# EasyEDA Pro project Hausdeckenlicht.eprj

# Schematic Deckenlicht
Board Name: Board1; Create Date: 2026-02-10; Page Name: P1; Project Name: Hausdeckenlicht; Schematic Name: Deckenlicht; Update Date: 2026-03-19; Company: EasyEDA.com; Page Size: A4; Version: V1.1
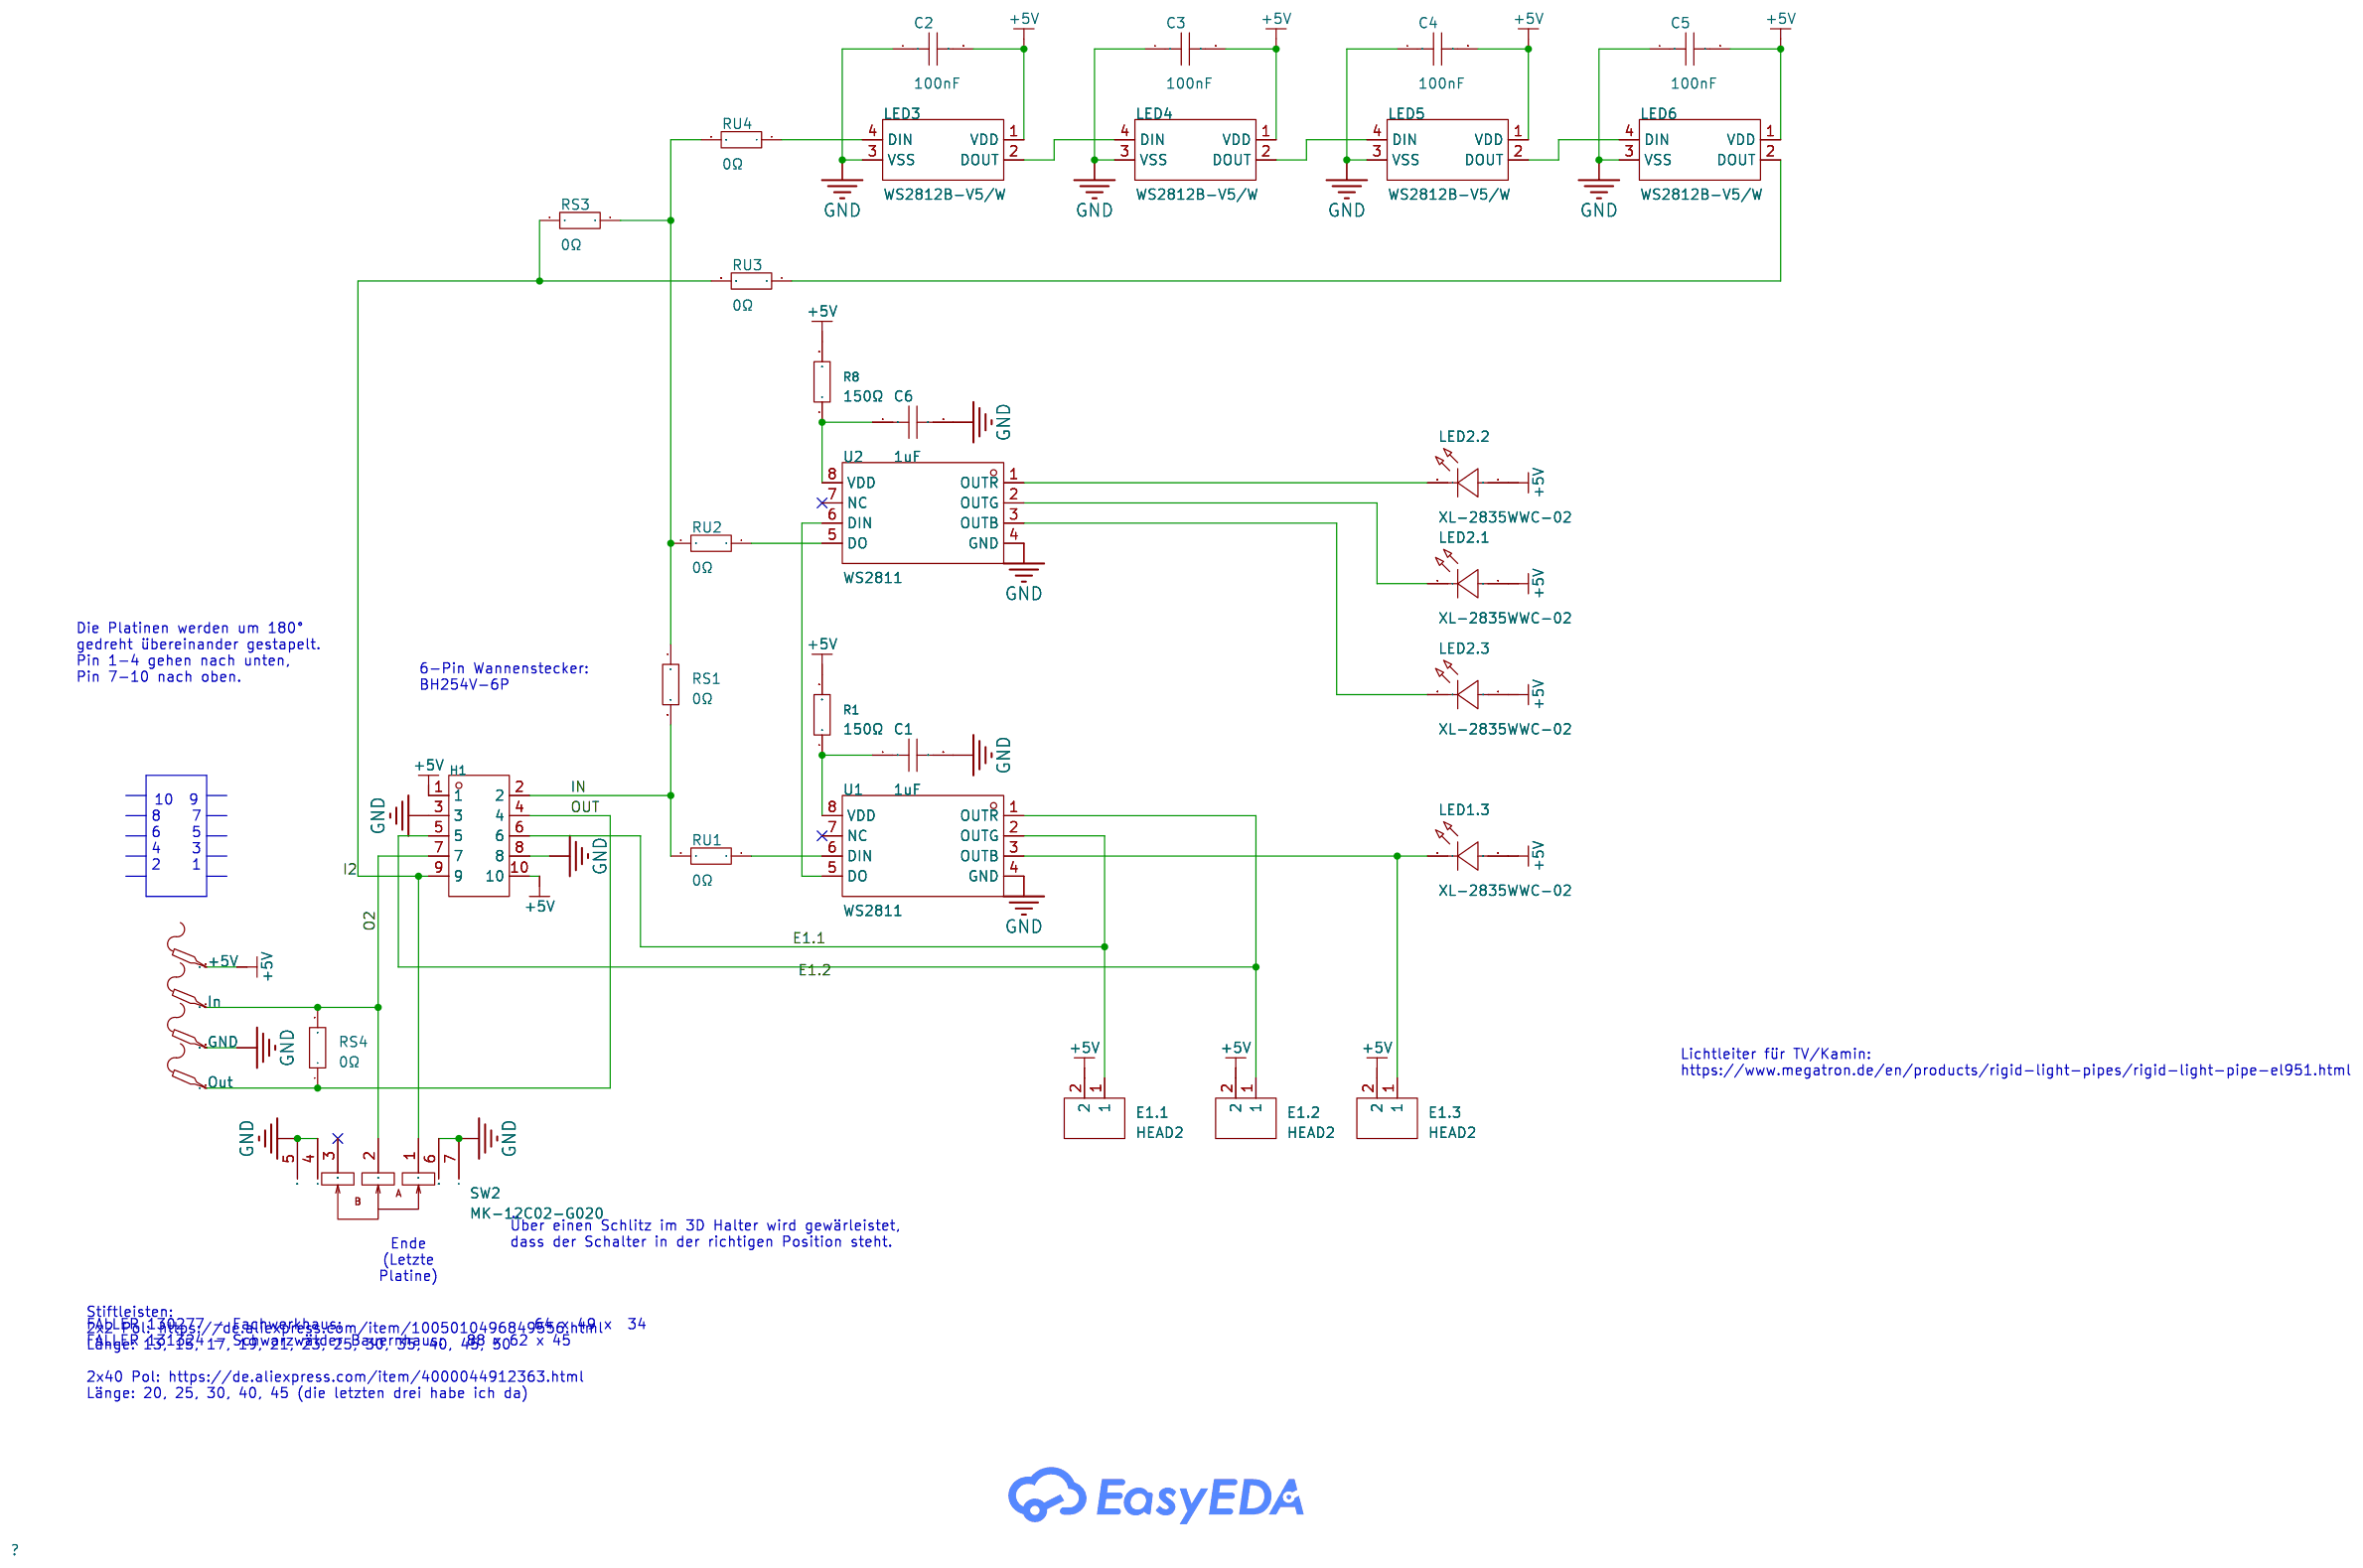
[diagram p0: schematic sheet]

## Parts
+5V  -  [Test-Point-0.5mm]
C1  1uF  [C0603]
C2  100nF  [C0603]
C3  100nF  [C0603]
C4  100nF  [C0603]
C5  100nF  [C0603]
C6  1uF  [C0603]
E1.1  HEAD2  [HDR-TH_2P-P2.54-V-M]  (no BOM)
E1.2  HEAD2  [HDR-TH_2P-P2.54-V-M]  (no BOM)
E1.3  HEAD2  [HDR-TH_2P-P2.54-V-M]  (no BOM)
GND  -  [Test-Point-0.5mm]
H1  2.54-2*5P立贴母  [CONN-SMD_C843271]
In  -  [Test-Point-0.5mm]
LED1.3  XL-2835WWC-02  [LED-SMD_L3.5-W2.8-R-RD]
LED2.1  XL-2835WWC-02  [LED-SMD_L3.5-W2.8-R-RD]
LED2.2  XL-2835WWC-02  [LED-SMD_L3.5-W2.8-R-RD]
LED2.3  XL-2835WWC-02  [LED-SMD_L3.5-W2.8-R-RD]
LED3  WS2812B-V5/W  [LED-SMD_4P-L5.0-W5.0-TL-1]
LED4  WS2812B-V5/W  [LED-SMD_4P-L5.0-W5.0-TL-1]
LED5  WS2812B-V5/W  [LED-SMD_4P-L5.0-W5.0-TL-1]
LED6  WS2812B-V5/W  [LED-SMD_4P-L5.0-W5.0-TL-1]
Out  -  [Test-Point-0.5mm]
R1  150Ω  [R0603]
R8  150Ω  [R0603]
RS1  0Ω  [R0603]  (no BOM)
RS3  0Ω  [R0603]  (no BOM)
RS4  0Ω  [R0603]
RU1  0Ω  [R0603]
RU2  0Ω  [R0603]
RU3  0Ω  [R0603]
RU4  0Ω  [R0603]
SW2  MK-12C02-G020  [SW-SMD_MK-12C02-G020]
U1  WS2811  [SOP-8_L4.9-W3.9-P1.27-LS6.0-BL]
U2  WS2811  [SOP-8_L4.9-W3.9-P1.27-LS6.0-BL]

## Library data of the parts
+5V GND In Out = Test-Point
C1 C6 = CL10A105KB8NNNC: LCSC Part Name: 1uF ±10% 50V; Supplier Part: C15849; Manufacturer: SAMSUNG(三星); Supplier Footprint: 0603; JLCPCB Part Class: Basic Part; Datasheet: https://item.szlcsc.com/datasheet/CL10A105KB8NNNC/16531.html; Supplier: LCSC; Tolerance: ±10%; Voltage Rating: 50V; Temperature Coefficient: X5R
C2-C5 = CC0603KRX7R9BB104: LCSC Part Name: 100nF ±10% 50V; Supplier Part: C14663; Manufacturer: YAGEO(国巨); Supplier Footprint: 0603; JLCPCB Part Class: Basic Part; Datasheet: https://item.szlcsc.com/datasheet/CC0603KRX7R9BB104/15331.html; Supplier: LCSC; Tolerance: ±10%; Voltage Rating: 50V; Temperature Coefficient: X7R
E1.1-E1.3 = HEAD2: Supplier Part: C9900010030; Supplier Footprint: HDR-TH_2P-P2.54; JLCPCB Part Class: Extended Part; Supplier: LCSC
H1 = 2.54-2*5P立贴母: LCSC Part Name: 间距:2.54mm 2x5P 立贴; Supplier Part: C843271; Manufacturer: BOOMELE(博穆精密); Supplier Footprint: SMD,P=2.54mm; JLCPCB Part Class: Extended Part; Datasheet: https://item.szlcsc.com/datasheet/2.54-2*5P%25E7%25AB%258B%25E8%25B4%25B4%25E6%25AF%258D/902207.html; Supplier: LCSC; Holes Structure: 2x5P; Pitch: 2.54mm; Row Spacing: 2.54mm; Circular Hole / Square Hole: Square Hole; Mounting Type: Surface Mount,Vertical; Number of Rows: 2; Number of Positions: 10P; Current Rating: 2.5A; Holes Direction: Top; Insulation Height: 8.5mm; Contact Material: Brass; Contact Plating: Gold; Operating Temperature: -55℃~+105℃
LED1.3 LED2.1-LED2.3 = XL-2835WWC-02: LCSC Part Name: 暖白色 2835暖白0.2W贴片式发光二极管; Supplier Part: C2843875; Manufacturer: XINGLIGHT(成兴光); Supplier Footprint: SMD2835-2P; JLCPCB Part Class: Extended Part; Datasheet: https://item.szlcsc.com/datasheet/XL-2835WWC-02/3033176.html; Supplier: LCSC; Illumination Color: Warm White; Voltage - Forward(Vf): 3.4V; Power(Watts): 200mW; Forward Current: 60mA; Lens Color: Yellow Lens; Color Temperature: 2900K~3100K; Viewing Angle: 120°; Mounting Style: op View Mount; Operating Temperature: -20℃~+85℃
LED3-LED6 = WS2812B-V5/W: LCSC Part Name: RGB三色; Supplier Part: C2874885; Manufacturer: worldsemi; Supplier Footprint: SMD5050; JLCPCB Part Class: Extended Part; Datasheet: https://atta.szlcsc.com/upload/public/pdf/source/20241202/615CE05766148E9C4DD7D8CE8DBC7337.pdf; Supplier: LCSC
R1 R8 = 0603WAF1500T5E: LCSC Part Name: 150Ω ±1% 100mW 厚膜电阻; Supplier Part: C22808; Manufacturer: UNI-ROYAL(厚声); Supplier Footprint: 0603; JLCPCB Part Class: Basic Part; Datasheet: https://atta.szlcsc.com/upload/public/pdf/source/20200306/C422600_1E6D84923E4A46A82E41ADD87F860B5C.pdf; Supplier: LCSC; Type: Thick Film Resistors; Tolerance: ±1%; Temperature Coefficient: ±100ppm/℃; Operating Temperature Range: -55℃~+155℃
RS1 RS3 RS4 RU1-RU4 = 0603WAF0000T5E: LCSC Part Name: 0Ω ±1% 100mW 厚膜电阻; Supplier Part: C21189; Manufacturer: UNI-ROYAL(厚声); Supplier Footprint: 0603; JLCPCB Part Class: Basic Part; Datasheet: https://item.szlcsc.com/datasheet/0603WAF0000T5E/21903.html; Supplier: LCSC; Type: Thick Film Resistor; Tolerance: ±1%; Power(Watts): 100mW; Voltage-Supply(Max): 75V; Operating Temperature: -55℃~+155℃
SW2 = MK-12C02-G020: LCSC Part Name: 微型拨动开关; Supplier Part: C963206; Manufacturer: G-Switch(品赞); Supplier Footprint: SMD,6.6x1.4mm; JLCPCB Part Class: Extended Part; Datasheet: https://item.szlcsc.com/datasheet/MK-12C02-G020/1046841.html; Supplier: LCSC; Circuit: SPDT; Actuator Style: Rectangular Columnar; Length: 6.6mm; Width: 1.4mm; Switch Height: 4.7mm; Mounting Type: Surface Mount, Right Angle; Actuator Color: Black; Current Rating: 1A; Voltage Rating: 6V; Life: 10,000 Cycles; Operating Temperature: -20℃~+70℃
U1 U2 = WS2811: Supplier Part: C114581; Manufacturer: worldsemi; Supplier Footprint: SOP-8; JLCPCB Part Class: Extended Part; Datasheet: https://item.szlcsc.com/datasheet/WS2811/115825.html; Supplier: LCSC; Voltage - Input(DC): 5V~24V; Frequency - Switching: 800kHz; Number of Channels: 3; Output Voltage: 20V; Output Current: 16.5mA; Dimming: PWM; Operating temperature: -25℃~+85℃

## Nets
+5V: +5V.1 C2.2 C3.2 C4.2 C5.2 E1.1.2 E1.2.2 E1.3.2 H1.1 H1.10 LED1.3.1(A) LED2.1.1(A) LED2.2.1(A) LED2.3.1(A) LED3.1(VDD) LED4.1(VDD) LED5.1(VDD) LED6.1(VDD) R1.2 R8.2
GND: C1.2 C2.1 C3.1 C4.1 C5.1 C6.2 GND.1 H1.3 H1.8 LED3.3(VSS) LED4.3(VSS) LED5.3(VSS) LED6.3(VSS) SW2.4 SW2.5 SW2.6 SW2.7 U1.4(GND) U2.4(GND)
E1.1: E1.1.1 H1.6 U1.2(OUTG)
E1.2: E1.2.1 H1.5 U1.1(OUTR)
I2: H1.9 RS3.2 RU3.2 SW2.1
IN: H1.2 RS1.2 RU1.2
O2: H1.7 In.1 RS4.2 SW2.2
OUT: H1.4 Out.1 RS4.1
$1N2323: E1.3.1 LED1.3.2(K) U1.3(OUTB)
$1N2342: C1.1 R1.1 U1.8(VDD)
$1N3914: C6.1 R8.1 U2.8(VDD)
$1N3929: LED2.1.2(K) U2.2(OUTG)
$1N3934: LED2.3.2(K) U2.3(OUTB)
$1N3939: LED2.2.2(K) U2.1(OUTR)
$1N4178: LED3.2(DOUT) LED4.4(DIN)
$1N4186: LED4.2(DOUT) LED5.4(DIN)
$1N4194: LED5.2(DOUT) LED6.4(DIN)
$1N5592: LED3.4(DIN) RU4.1
$1N5642: LED6.2(DOUT) RU3.1
$1N5658: U1.5(DO) U2.6(DIN)
$1N5698: RU1.1 U1.6(DIN)
$1N5721: RU2.1 U2.5(DO)
$1N5728: RS1.1 RS3.1 RU2.2 RU4.2

Not connected (* = marked no-connect by the designer): SW2 3*; U1 7(NC)*; U2 7(NC)*

## Notes on the sheet
- Die Platinen werden um 180°
  gedreht übereinander gestapelt.
  Pin 1-4 gehen nach unten,
  Pin 7-10 nach oben.
- 6-Pin Wannenstecker:
  BH254V-6P
- 10  9
  8    7
  6    5
  4    3
  2    1
- Lichtleiter für TV/Kamin:
  https://www.megatron.de/en/products/rigid-light-pipes/rigid-light-pipe-el951.html
- Ende
  (Letzte
  Platine)
- Über einen Schlitz im 3D Halter wird gewärleistet,
  dass der Schalter in der richtigen Position steht.
- FALLER 130277 - Fachwerkhaus:                         64 x 49 x  34
  FALLER 131324 - Schwarzwälder Bauernhaus:   88 x 62 x 45
- Stiftleisten:
  2x2 Pol: https://de.aliexpress.com/item/1005010496849556.html
  Länge: 13, 15, 17, 19, 21, 23, 25, 30, 35, 40, 45, 50
  2x40 Pol: https://de.aliexpress.com/item/4000044912363.html
  Länge: 20, 25, 30, 40, 45 (die letzten drei habe ich da)

# Schematic Dachlicht
Board Name: Dachlicht; Create Date: 2026-02-17; Page Name: P1; Project Name: Hausdeckenlicht; Schematic Name: Dachlicht; Update Date: 2026-03-19; Company: EasyEDA.com; Page Size: A4; Version: V1.1
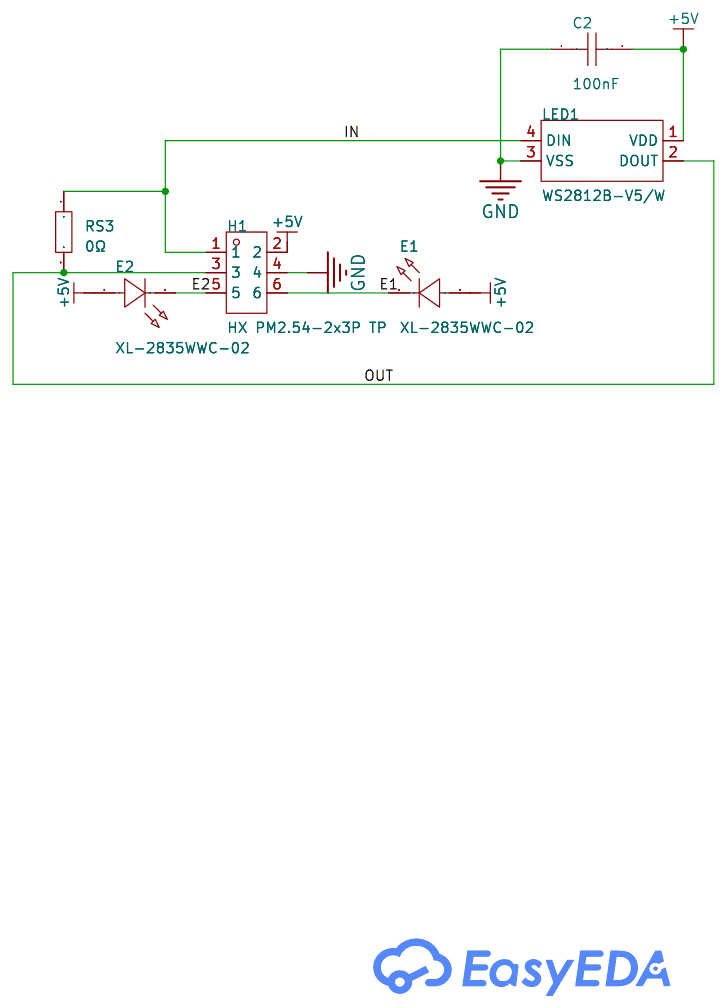
[diagram p1: schematic sheet]

## Parts
C2  100nF  [C0603]
E1  XL-2835WWC-02  [LED-SMD_L3.5-W2.8-R-RD]
E2  XL-2835WWC-02  [LED-SMD_L3.5-W2.8-R-RD]
H1  HX PM2.54-2x3P TP  [HDR-SMD_6P-P2.54-V-M-R2-C3-LS7.6]
LED1  WS2812B-V5/W  [LED-SMD_4P-L5.0-W5.0-TL-1]
RS3  0Ω  [R0603]  (no BOM)

## Library data of the parts
C2 = CC0603KRX7R9BB104: LCSC Part Name: 100nF ±10% 50V; Supplier Part: C14663; Manufacturer: YAGEO(国巨); Supplier Footprint: 0603; JLCPCB Part Class: Basic Part; Datasheet: https://item.szlcsc.com/datasheet/CC0603KRX7R9BB104/15331.html; Supplier: LCSC; Tolerance: ±10%; Voltage Rating: 50V; Temperature Coefficient: X7R
E1 E2 = XL-2835WWC-02: LCSC Part Name: 暖白色 2835暖白0.2W贴片式发光二极管; Supplier Part: C2843875; Manufacturer: XINGLIGHT(成兴光); Supplier Footprint: SMD2835-2P; JLCPCB Part Class: Extended Part; Datasheet: https://item.szlcsc.com/datasheet/XL-2835WWC-02/3033176.html; Supplier: LCSC; Illumination Color: Warm White; Voltage - Forward(Vf): 3.4V; Power(Watts): 200mW; Forward Current: 60mA; Lens Color: Yellow Lens; Color Temperature: 2900K~3100K; Viewing Angle: 120°; Mounting Style: op View Mount; Operating Temperature: -20℃~+85℃
H1 = HX PM2.54-2x3P TP: Holes Structure:2x3P Pitch:2.54mm Row Spacing:2.54mm Circular Hole / Square Hole:Square Hole Mounting Type:Surface Mount,Vertical Number of Rows:2 Number of Positions:6P Current Rating:3A Voltage Rating (Max):1kV Holes Direction:Top Insulation Height:8.5m; LCSC Part Name: 2x3P 间距:2.54mm 立贴; Supplier Part: C41397152; Manufacturer: hanxia(韩下); Supplier Footprint: SMD,P=2.54mm; JLCPCB Part Class: Extended Part; Datasheet: https://item.szlcsc.com/datasheet/HX%2520PM2.54-2x3P%2520TP/43189214.html; Supplier: LCSC; Holes Structure: 2x3P; Pitch: 2.54mm; Row Spacing: 2.54mm; Circular Hole / Square Hole: Square Hole; Mounting Type: Surface Mount,Vertical; Number of Rows: 2; Number of Positions: 6P; Current Rating: 3A; Voltage Rating (Max): 1kV; Holes Direction: Top; Insulation Height: 8.5mm; Contact Material: Brass; Contact Plating: Gold; Operating Temperature: -40℃~+105℃
LED1 = WS2812B-V5/W: LCSC Part Name: RGB三色; Supplier Part: C2874885; Manufacturer: worldsemi; Supplier Footprint: SMD5050; JLCPCB Part Class: Extended Part; Datasheet: https://atta.szlcsc.com/upload/public/pdf/source/20241202/615CE05766148E9C4DD7D8CE8DBC7337.pdf; Supplier: LCSC
RS3 = 0603WAF0000T5E: LCSC Part Name: 0Ω ±1% 100mW 厚膜电阻; Supplier Part: C21189; Manufacturer: UNI-ROYAL(厚声); Supplier Footprint: 0603; JLCPCB Part Class: Basic Part; Datasheet: https://item.szlcsc.com/datasheet/0603WAF0000T5E/21903.html; Supplier: LCSC; Type: Thick Film Resistor; Tolerance: ±1%; Power(Watts): 100mW; Voltage-Supply(Max): 75V; Operating Temperature: -55℃~+155℃

## Nets
+5V: C2.2 E1.1(A) E2.1(A) H1.2 LED1.1(VDD)
GND: C2.1 H1.4 LED1.3(VSS)
E1: E1.2(K) H1.6
E2: E2.2(K) H1.5
IN: H1.1 LED1.4(DIN) RS3.1
OUT: H1.3 LED1.2(DOUT) RS3.2

# Board PCB1
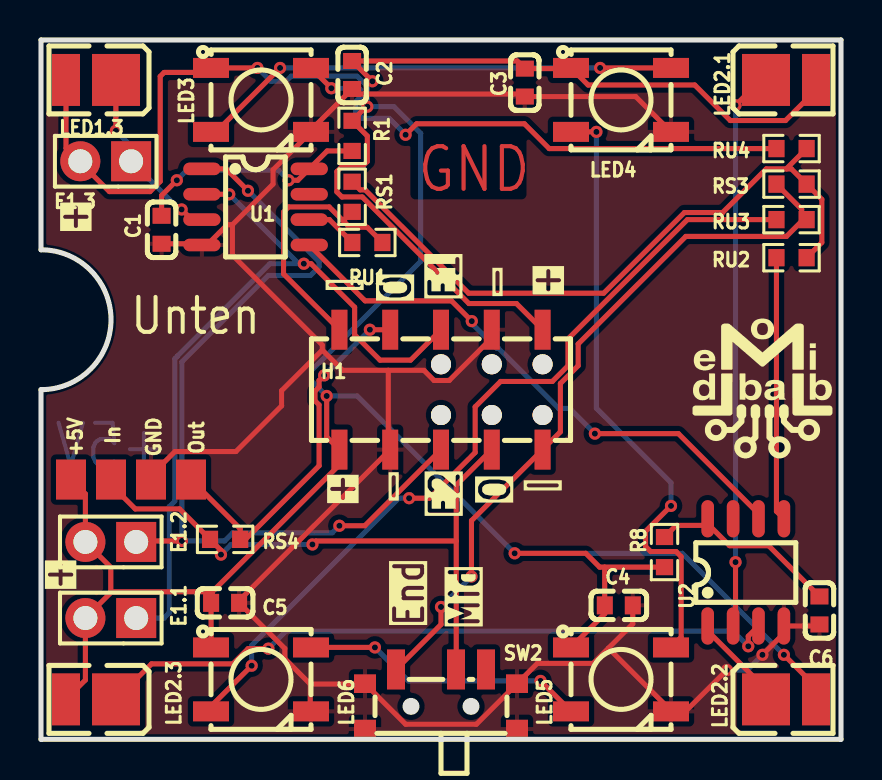
[diagram p2: board, top side]
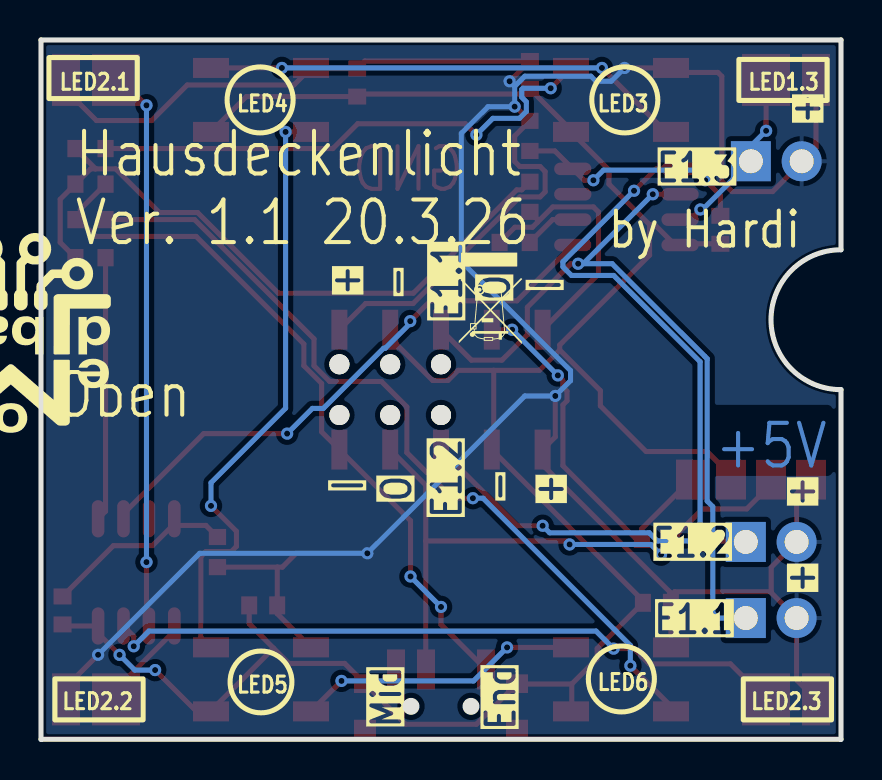
[diagram p3: board, bottom side, seen from below]

Outline 40 x 35 mm; copper layers: Top Layer, Bottom Layer. Coordinates in mm from the lower left corner of the outline.
Outline path: 0,35 0,24.5 arc(3.5,21) 0,17.5 0,0 40,0 40,35 0,35
Stack: Top Layer 0.035mm / Dielectric1 0.91mm FR4 er 4.5 / Bottom Layer 0.035mm

## Design rules (mm)
template: JLCPCB Capability(Two Layers Board)
spacing copperThickness1oz (default): track to track 0.102, other pairs 0.152 to 0.3
spacing copperThickness2oz: track to track 0.203, other pairs 0.152 to 0.3
track width copperThickness1oz (default): min 0.127, default 0.254, max 2.54
track width copperThickness2oz: min 0.203, default 0.254, max 2.54
differential pair differentialPair (default): width min 0.127, default 0.254, max 2.54; gap min 0.152, default 0.152
via viaSize (default): diameter min 0.5, default 0.61, max 10; hole min 0.3, default 0.305, max 6.3

## Placement (name value [footprint] x y rotation side)
+5V  -  [Test-Point-0.5mm]  1.5 13 180 top
C1  1uF  [C0603]  6.03 25.5 270 top
C2  100nF  [C0603]  15.56 33.25 90 top
C3  100nF  [C0603]  24.19 32.87 90 top
C4  100nF  [C0603]  28.89 6.7 180 top
C5  100nF  [C0603]  9.21 6.83 180 top
C6  1uF  [C0603]  38.92 6.45 270 top
E1.1  HEAD2  [HDR-TH_2P-P2.54-V-M]  3.49 6.07 180 top
E1.2  HEAD2  [HDR-TH_2P-P2.54-V-M]  3.49 9.88 180 top
E1.3  HEAD2  [HDR-TH_2P-P2.54-V-M]  3.24 28.93 180 top
GND  -  [Test-Point-0.5mm]  5.5 13 180 top
H1  2.54-2*5P立贴母  [CONN-SMD_C843271]  20 17.5 0 top
In  -  [Test-Point-0.5mm]  3.5 13 180 top
LED1.3  XL-2835WWC-02  [LED-SMD_L3.5-W2.8-R-RD]  2.5 33 180 top
LED2.1  XL-2835WWC-02  [LED-SMD_L3.5-W2.8-R-RD]  37.5 33 0 top
LED2.2  XL-2835WWC-02  [LED-SMD_L3.5-W2.8-R-RD]  37.5 2 0 top
LED2.3  XL-2835WWC-02  [LED-SMD_L3.5-W2.8-R-RD]  2.5 2 180 top
LED3  WS2812B-V5/W  [LED-SMD_4P-L5.0-W5.0-TL-1]  11 32 0 top
LED4  WS2812B-V5/W  [LED-SMD_4P-L5.0-W5.0-TL-1]  29 32 0 top
LED5  WS2812B-V5/W  [LED-SMD_4P-L5.0-W5.0-TL-1]  29 3 0 top
LED6  WS2812B-V5/W  [LED-SMD_4P-L5.0-W5.0-TL-1]  11 3 0 top
NOREF  -  [Pad_e49]  25.08 18.77 0 top
NOREF#2  -  [Pad_e53]  20 16.23 0 top
NOREF#3  -  [Pad_e48]  22.54 16.23 0 top
NOREF#4  -  [Pad_e46]  22.54 18.77 0 top
NOREF#5  -  [Pad_e52]  20 18.77 0 top
NOREF#6  -  [Pad_e50]  25.08 16.23 0 top
Out  -  [Test-Point-0.5mm]  7.5 13 180 top
R1  150Ω  [R0603]  15.56 30.2 90 top
R8  150Ω  [R0603]  31.18 9.37 270 top
RS1  0Ω  [R0603]  15.56 27.15 270 top
RS3  0Ω  [R0603]  37.53 27.79 180 top
RS4  0Ω  [R0603]  9.21 10.01 180 top
RU1  0Ω  [R0603]  16.32 24.87 0 top
RU2  0Ω  [R0603]  37.53 24.1 0 top
RU3  0Ω  [R0603]  37.53 26.01 0 top
RU4  0Ω  [R0603]  37.53 29.56 0 top
SW2  MK-12C02-G020  [SW-SMD_MK-12C02-G020]  20 2.01 0 top
U1  WS2811  [SOP-8_L4.9-W3.9-P1.27-LS6.0-BL]  10.73 26.64 270 top
U2  WS2811  [SOP-8_L4.9-W3.9-P1.27-LS6.0-BL]  35.24 8.36 0 top

## Footprints (pads in the part's own frame, mm; a bottom-side part is the same pattern mirrored in y, then rotated)
C0603
  rect 0.8x0.9 smd: 1(-0.7,0) 2(0.7,0)
CONN-SMD_C843271
  rect 0.8x2 smd: 1(-5.08,-3) 2(-5.08,3) 3(-2.54,-3) 4(-2.54,3) 5(0,-3) 6(0,3) 7(2.54,-3) 8(2.54,3) 9(5.08,-3) 10(5.08,3)
HDR-TH_2P-P2.54-V-M
  rect 2x2 hole 1.2: 1(-1.27,0)
  round 2 hole 1.2: 2(1.27,0)
LED-SMD_4P-L5.0-W5.0-TL-1
  rect 1.8x1 smd: 1(-2.5,1.6) 2(-2.5,-1.6) 3(2.5,-1.6) 4(2.5,1.6)
LED-SMD_L3.5-W2.8-R-RD
  rect 1.4x2.6 smd: 1(1.25,0)
  rect 2.4x2.6 smd: 2(-1.25,0)
Pad_e46
  round 1 hole 1: 3(0,0)
Pad_e48
  round 1 hole 1: 4(0,0)
Pad_e49
  round 1 hole 1: 1(0,0)
Pad_e50
  round 1 hole 1: 2(0,0)
Pad_e52
  round 1 hole 1: 5(0,0)
Pad_e53
  round 1 hole 1: 6(0,0)
R0603
  rect 0.806x0.864 smd: 1(-0.753,0) 2(0.753,0)
SOP-8_L4.9-W3.9-P1.27-LS6.0-BL
  oval 0.63x1.865 smd: 1(-1.905,-2.683) 2(-0.635,-2.683) 3(0.635,-2.683) 4(1.905,-2.683) 5(1.905,2.683) 6(0.635,2.683) 7(-0.635,2.683) 8(-1.905,2.683)
SW-SMD_MK-12C02-G020
  rect 0.9x2 smd: 1(-2.25,1.49) 2(0.75,1.49) 3(2.25,1.49)
  rect 1.1x0.93 smd: 4(3.8,0.779) 5(3.8,-1.49) 6(-3.8,-1.49) 7(-3.8,0.779)
Test-Point-0.5mm
  rect 1.5x2 smd: 1(0,0)

## Nets
As in the schematic.

Pads without a net: NOREF 1; NOREF#2 6; NOREF#3 4; NOREF#4 3; NOREF#5 5; NOREF#6 2; SW2 3; U1 7; U2 7

## Via types
v1: diameter 0.61, hole 0.305, Top Layer to Bottom Layer, 39 vias

## Routing (per net, layer and track width the routed paths; a pad name or vN(x,y) marks a point on that pad's centre or on a via; arc(x,y) is an arc through that point)
+5V: length 169.4
  Top Layer w0.254: 1.9,28.94 E1.3.2 ; 1.9,28.94 3.42,27.41 5.45,27.41 5.96,27.92 5.96,33.18 6.16,33.38 8.28,33.38 LED3.1 v1(10.82,33.6) ; 1.9,28.94 1.25,29.58 LED1.3.1 ; 3.49,7.39 3.49,8.61 E1.2.2 2.22,12.28 +5V.1 ; 3.49,7.39 3.49,7.34 E1.1.2 2.22,2.97 LED2.3.1 ; 3.49,7.39 8.32,7.39 8.57,7.13 ; C4.2 28.19,6.29 LED5.1 ; v1(37.15,4.23) 38.75,2.62 LED2.2.1 ; v1(23.68,9.31) 27.24,9.31 27.93,8.62 28.18,8.62 ; 28.18,8.62 28.18,6.71 ; 28.18,8.62 R8.2 ; LED2.1.1 38.75,32.49 37.23,30.97 34.47,30.97 32.69,32.75 27.35,32.75 LED4.1 26.47,33.57 C3.2 23.81,33.95 C2.2 v1(16.57,32.93) ; 8.57,7.13 8.5,6.83 8.5,4.61 ; 8.57,7.13 8.57,7.39 14.92,13.74 H1.1 14.28,15.14 v1(14.28,17.18) ; v1(16.32,31.66) 16.26,31.66 R1.2 16.32,30.19 16.32,28.92 16.06,28.67 15.05,28.67 14.79,28.41 14.79,27.4 15.05,27.14 16.06,27.14 21.4,21.81 23.77,21.81 H1.10
  Bottom Layer w0.254: v1(16.57,32.93) 16.32,32.68 ; 16.32,32.68 15.81,33.19 12.51,33.19 12.25,32.93 11.49,32.93 v1(10.82,33.6) ; 16.32,32.68 v1(16.32,31.66) 17.65,31.66 18.98,30.33 18.98,23.92 13.52,18.45 13.52,17.95 v1(14.28,17.18) 15.81,17.18 v1(23.68,9.31) 32.06,9.31 v1(37.15,4.23)
GND: length 116
  Top Layer w0.254: 28.37,4.56 31.5,1.44 ; 28.37,4.56 29.59,5.78 C4.1 ; 28.37,4.56 27.61,3.8 24.82,3.8 SW2.4 21.77,0.75 18.23,0.75 SW2.7 16.18,2.77 13.46,2.77 ; 31.5,1.44 LED5.3 ; 31.5,1.44 32.26,1.44 v1(34.29,3.47) ; H1.8 22.45,20.41 22.45,19.99 20.41,17.96 19.65,17.96 19.14,18.47 17.37,18.47 ; 17.37,18.47 17.37,14.59 H1.3 9.91,6.94 C5.1 12.19,4.55 12.19,4.04 13.46,2.77 ; 17.37,18.47 15.08,18.47 14.06,19.48 ; v1(36.07,4.23) 37.15,5.3 U2.4 38.85,5.67 38.92,5.75 ; 14.06,19.48 14.06,19.74 9.57,24.23 9.57,25.75 ; 14.06,19.48 12.03,17.45 12.03,16.69 9.75,14.4 6.7,14.4 5.5,13.21 GND.1 ; 13.46,2.77 13.46,1.44 LED6.3 ; 9.57,25.75 9.32,25.75 8.3,24.74 U1.4 7.98,24.8 C1.2 ; 9.57,25.75 11.6,27.79 11.6,28.5 LED3.3 13.5,30.49 C2.1 15.81,32.29 24.06,32.29 C3.1 29.73,32.17 LED4.3
  Bottom Layer w0.254: v1(34.29,3.47) 35.31,3.47 v1(36.07,4.23)
E1.1: length 39.6
  Top Layer w0.254: v1(9.41,27.28) U1.2 ; v1(13.14,23.8) 13.5,23.8 15.68,21.62 15.68,20.25 16.95,18.98 18.48,18.98 H1.6
  Bottom Layer w0.254: v1(13.14,23.8) 12.89,23.8 ; 12.89,23.8 11.44,23.8 6.82,19.18 6.82,19.17 6.69,19.04 6.69,11.92 6.41,11.64 6.41,6.32 6.16,6.07 E1.1.1 ; 12.89,23.8 v1(9.41,27.28)
E1.2: length 43
  Top Layer w0.254: E1.2.1 4.81,9.93 v1(7.05,9.93) ; U1.1 9.25,28.55 v1(10.35,27.45) ; H1.5 16.19,10.69 v1(14.92,10.69)
  Bottom Layer w0.254: v1(14.92,10.69) 14.57,10.34 9.59,10.34 9.18,9.93 v1(7.05,9.93) 7.05,18.9 11.36,23.22 13.47,23.22 13.9,23.64 13.9,23.9 v1(10.35,27.45)
I2: length 36.4
  Top Layer w0.254: 38.03,25.93 38.03,26.53 RS3.2 ; 38.03,25.93 37.27,25.17 32.24,25.17 26.86,19.79 26.86,18.7 25.97,17.81 25.97,15.39 H1.9 21.52,10.94 v1(21.52,8.15) ; 38.03,25.93 38.2,25.93 RU3.2 ; v1(20,6.63) 20,5.75 SW2.1
  Bottom Layer w0.254: v1(21.52,8.15) v1(20,6.63)
IN: length 13.5
  Top Layer w0.254: 15.17,25.88 15.43,25.63 16.31,25.63 RU1.2 ; 15.17,25.88 14.41,26.64 12.38,26.64 12.13,26.39 12.13,23.29 H1.2 ; 15.17,25.88 15.17,26.02 RS1.2
O2: length 31.1
  Top Layer w0.254: 20.76,9.93 20.76,12.72 H1.7 ; 20.76,9.93 13.75,9.93 v1(13.57,9.75) ; 20.76,9.93 20.76,3.51 SW2.2 ; v1(9,9.25) 9,9.46 RS4.2 6.93,11.53 4.72,11.53 3.5,12.75 In.1
  Bottom Layer w0.254: v1(13.57,9.75) 9.51,9.75 v1(9,9.25)
OUT: length 18.5
  Top Layer w0.254: H1.4 v1(16.44,20.5) ; Out.1 9.96,10.54 RS4.1 10.22,10.01 13.9,13.69 13.9,16.74 13.7,16.94 13.7,17.43 13.9,17.63 13.9,17.96 v1(14.16,18.21)
  Bottom Layer w0.254: v1(16.44,20.5) v1(14.16,18.21)
$1N2323: length 9.1
  Top Layer w0.254: v1(7.03,26.52) 7.54,26.01 U1.3 ; v1(3.74,30.45) 3.74,32.99
  Bottom Layer w0.254: v1(7.03,26.52) 6.92,26.52 E1.3.1 4.51,29.69 v1(3.74,30.45)
$1N2342: length 11.9
  Top Layer w0.254: v1(12.38,27.98) 12.84,27.98 U1.8 14.31,29.45 R1.1 ; 6.03,26.2 6.03,27.22 v1(6.79,27.98)
  Bottom Layer w0.254: v1(6.79,27.98) 7.3,28.49 11.87,28.49 v1(12.38,27.98)
$1N3914: length 9.8
  Top Layer w0.254: U2.8 33.41,10.96 33.41,10.71 ; 33.41,10.71 34.43,9.69 36.38,9.69 C6.1 ; 33.41,10.71 31.76,10.71 R8.1
$1N3929: length 28.2
  Top Layer w0.254: v1(34.73,8.87) 34.73,5.79 34.6,5.67 ; v1(34.73,31.73) 36,33 LED2.1.2
  Bottom Layer w0.254: v1(34.73,31.73) v1(34.73,8.87)
$1N3934: length 34.6
  Top Layer w0.254: LED2.3.2 5.53,3.78 9.59,3.78 10.35,4.54 v1(11.37,4.54) ; v1(35.36,4.66) 35.36,5.16 U2.3
  Bottom Layer w0.254: v1(11.37,4.54) 12.25,5.42 34.6,5.42 v1(35.36,4.66)
$1N3939: length 4.9
  Top Layer w0.254: U2.1 33.46,5.55 33.46,5.3 36.25,2.51 LED2.2.2
$1N4178: length 24.3
  Top Layer w0.254: v1(11.95,33.6) 8.75,30.4 LED3.2 ; v1(27.96,33.6) LED4.4
  Bottom Layer w0.254: v1(11.95,33.6) v1(27.96,33.6)
$1N4186: length 30.8
  Top Layer w0.254: LED5.4 32.01,5.11 32.01,9.14 31.75,9.4 30.48,9.4 30.23,9.65 30.23,10.41 v1(31.5,11.68) ; LED4.2 v1(27.77,30.4)
  Bottom Layer w0.254: v1(31.5,11.68) 31.5,12.84 27.77,16.57 v1(27.77,30.4)
$1N4194: length 14.3
  Top Layer w0.254: v1(16.7,4.6) LED6.4 ; LED5.2 v1(24.98,2.92)
  Bottom Layer w0.254: v1(24.98,2.92) 18.37,2.92 v1(16.7,4.6)
$1N5592: length 26.4
  Top Layer w0.254: LED3.4 v1(14.52,32.58) ; RU4.1 25.41,29.56 24.17,30.81 18.78,30.81 v1(18.23,30.25)
  Bottom Layer w0.254: v1(14.52,32.58) 15.9,32.58 15.96,32.52 15.96,32.13 15.73,31.9 15.73,31.42 16.07,31.08 17.41,31.08 v1(18.23,30.25)
$1N5642: length 41.3
  Top Layer w0.254: v1(18.41,12.07) 19.42,12.07 21.71,14.35 21.71,16.64 22.98,17.91 25.57,17.91 26.35,18.69 26.35,20.04 32.32,26.01 RU3.1 ; LED6.2 8.5,1.65 v1(10.53,3.69)
  Bottom Layer w0.254: v1(10.53,3.69) 10.53,4.7 17.9,12.07 v1(18.41,12.07)
$1N5658: length 28.4
  Top Layer w0.254: U2.6 35.77,11.14 35.77,11.39 31.87,15.3 v1(27.69,15.3) ; v1(21.54,20.93) 20.52,21.94 16.21,21.94 U1.5
  Bottom Layer w0.254: v1(21.54,20.93) 21.54,20.82 22.79,19.57 22.87,19.57 25.88,16.56 26.43,16.56 v1(27.69,15.3)
$1N5698: length 2.6
  Top Layer w0.254: U1.6 14.42,26.01 RU1.1
$1N5721: length 13.2
  Top Layer w0.254: U2.5 36.77,11.41 RU2.1
$1N5728: length 33.7
  Top Layer w0.254: 37.28,28.55 37.28,28.57 RU4.2 ; 37.28,28.55 36.26,28.55 34.08,26.36 32.17,26.36 28.13,22.33 21.38,22.33 16.21,27.5 15.96,27.5 RS1.1 ; 37.28,28.55 37.52,28.55 RS3.1 39.04,27.03 39.04,24.87 RU2.2

## Copper pours and planes (outline as drawn; the poured copper is in the pictures)
+5V on Bottom Layer: 0,35.25 40,35.25 40,0.25 0,0.25
GND on Top Layer: 0,35 40,35 40,0 0,0

## Text on the board
Bottom Layer: +5V
Bottom Silkscreen Layer: LED1.3 | LED2.1 | LED2.3 | LED3 | LED2.2 | LED6 | LED4 | LED5 | E1.1 | + | I | End | - | O | E1.2 | Mid | E1.3 | by Hardi | Hausdeckenlicht / Ver. 1.1 20.3.26 | Oben
Top Layer: GND
Top Silkscreen Layer: + | I | - | O | End | E2 | Mid | E1 | Unten

# Board PCB5
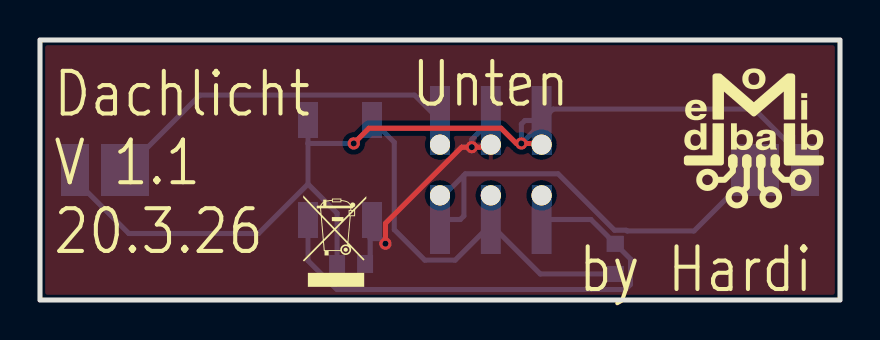
[diagram p4: board, top side]
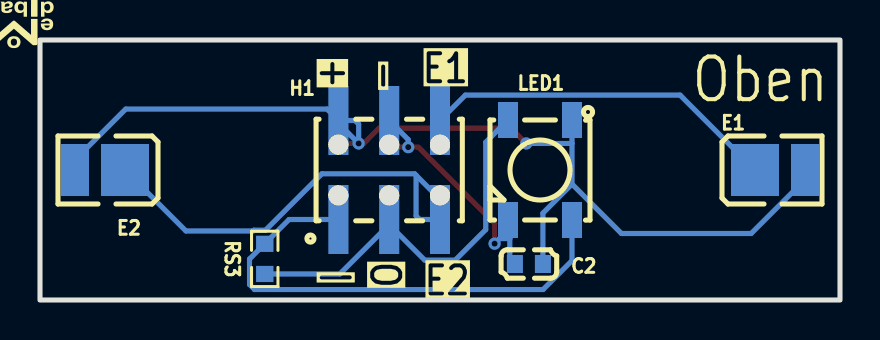
[diagram p5: board, bottom side, seen from below]

Outline 40 x 13 mm; copper layers: Top Layer, Bottom Layer. Coordinates in mm from the lower left corner of the outline.
Outline path: rectangle 0,13 40,0
Stack: Top Layer 0.035mm / Dielectric1 0.91mm FR4 er 4.5 / Bottom Layer 0.035mm

## Design rules (mm)
template: JLCPCB Capability(Two Layers Board)
spacing copperThickness1oz (default): track to track 0.102, other pairs 0.152 to 0.3
spacing copperThickness2oz: track to track 0.203, other pairs 0.152 to 0.3
track width copperThickness1oz (default): min 0.127, default 0.254, max 2.54
track width copperThickness2oz: min 0.203, default 0.254, max 2.54
differential pair differentialPair (default): width min 0.127, default 0.254, max 2.54; gap min 0.152, default 0.152
via viaSize (default): diameter min 0.5, default 0.61, max 10; hole min 0.3, default 0.305, max 6.3

## Placement (name value [footprint] x y rotation side)
C2  100nF  [C0603]  15.56 1.8 180 bottom
E1  XL-2835WWC-02  [LED-SMD_L3.5-W2.8-R-RD]  3 6.5 180 bottom
E2  XL-2835WWC-02  [LED-SMD_L3.5-W2.8-R-RD]  37 6.5 0 bottom
H1  HX PM2.54-2x3P TP  [HDR-SMD_6P-P2.54-V-M-R2-C3-LS7.6]  22.54 6.5 180 bottom
LED1  WS2812B-V5/W  [LED-SMD_4P-L5.0-W5.0-TL-1]  15 6.5 270 bottom
NOREF  -  [Pad_e22]  20 5.23 0 top
NOREF#2  -  [Pad_e17]  25.08 7.77 0 top
NOREF#3  -  [Pad_e21]  20 7.77 0 top
NOREF#4  -  [Pad_e18]  25.08 5.23 0 top
NOREF#5  -  [Pad_e19]  22.54 7.77 0 top
NOREF#6  -  [Pad_e20]  22.54 5.23 0 top
RS3  0Ω  [R0603]  28.76 2.06 270 bottom

## Footprints (pads in the part's own frame, mm; a bottom-side part is the same pattern mirrored in y, then rotated)
C0603
  rect 0.8x0.9 smd: 1(-0.7,0) 2(0.7,0)
HDR-SMD_6P-P2.54-V-M-R2-C3-LS7.6
  rect 1x3.45 smd: 1(-2.54,-2.475) 2(-2.54,2.475) 3(0,-2.475) 4(0,2.475) 5(2.54,-2.475) 6(2.54,2.475)
LED-SMD_4P-L5.0-W5.0-TL-1
  rect 1.8x1 smd: 1(-2.5,1.6) 2(-2.5,-1.6) 3(2.5,-1.6) 4(2.5,1.6)
LED-SMD_L3.5-W2.8-R-RD
  rect 1.4x2.6 smd: 1(1.25,0)
  rect 2.4x2.6 smd: 2(-1.25,0)
Pad_e17
  round 1 hole 1: 1(0,0)
Pad_e18
  round 1 hole 1: 2(0,0)
Pad_e19
  round 1 hole 1: 3(0,0)
Pad_e20
  round 1 hole 1: 4(0,0)
Pad_e21
  round 1 hole 1: 5(0,0)
Pad_e22
  round 1 hole 1: 6(0,0)
R0603
  rect 0.806x0.864 smd: 1(-0.753,0) 2(0.753,0)

## Nets
+5V: C2.2 E1.1 E2.1 H1.2 LED1.1 NOREF#2.1
GND: C2.1 H1.4 LED1.3 NOREF#5.3
E1: E1.2 H1.6 NOREF#3.5
E2: E2.2 H1.5 NOREF.6
IN: H1.1 LED1.4 NOREF#4.2 RS3.1
OUT: H1.3 LED1.2 NOREF#6.4 RS3.2

## Via types
v1: diameter 0.61, hole 0.305, Top Layer to Bottom Layer, 4 vias

## Routing (per net, layer and track width the routed paths; a pad name or vN(x,y) marks a point on that pad's centre or on a via; arc(x,y) is an arc through that point)
+5V: length 53
  Top Layer w0.254: v1(15.69,7.83) 16.45,8.59 23.05,8.59 23.81,7.83 25.02,7.83 NOREF#2.1
  Bottom Layer w0.254: H1.2 24.25,8.97 24.07,8.8 v1(24.07,7.83) 25.08,8.84 H1.2 ; H1.2 25.65,9.55 35.71,9.55 38.19,7.07 38.19,6.56 E2.1 ; E1.1 1.75,6.02 4.44,3.33 10.93,3.33 13.4,5.8 ; 13.4,5.8 13.4,7.83 ; 13.4,5.8 14.85,4.34 C2.2 ; 13.4,7.83 v1(15.69,7.83) ; 13.4,7.83 LED1.1
GND: length 12.9
  Top Layer w0.254: NOREF#5.3 22.41,7.64 v1(21.59,7.64) 21.08,7.64 17.27,3.83 v1(17.27,2.82)
  Bottom Layer w0.254: v1(17.27,2.82) 17.02,3.07 16.51,3.07 ; C2.1 16.51,2.06 16.51,3.07 ; v1(21.59,7.64) 21.59,8.02 H1.4 ; 16.51,3.07 16.51,3.91 LED1.3
E1: length 19
  Bottom Layer w0.254: NOREF#3.5 H1.6 18.73,10.25 8,10.25 E1.2
E2: length 23.2
  Bottom Layer w0.254: E2.2 32.7,3.45 29.35,3.45 29.31,3.49 28.72,3.49 25.9,6.31 21.27,6.31 21.2,6.24 ; 21.2,6.24 21.2,4.2 21.02,4.03 H1.5 20,5.04 ; 21.2,6.24 20,5.04 ; 20,5.04 NOREF.6
IN: length 26.6
  Bottom Layer w0.254: LED1.4 13.4,1.97 14.85,0.52 29.27,0.52 29.53,0.78 29.53,2.05 RS3.1 27.55,4.03 H1.1 NOREF#4.2
OUT: length 20.8
  Bottom Layer w0.254: NOREF#6.4 H1.3 22.54,3.77 ; 22.54,3.77 25.01,1.3 RS3.2 ; 22.54,3.77 20.76,1.99 19.24,1.99 17.71,3.52 17.71,7.89 LED1.2

## Copper pours and planes (outline as drawn; the poured copper is in the pictures)
GND on Top Layer: 0,13 40,13 40,0 0,0

## Text on the board
Bottom Silkscreen Layer: E2 | - | O | + | I | E1 | Oben
Top Silkscreen Layer: Dachlicht / V 1.1 / 20.3.26 | Unten | by Hardi
